# EAGLE schematic Switch and LED matrix (EAGLE 7.3.0)
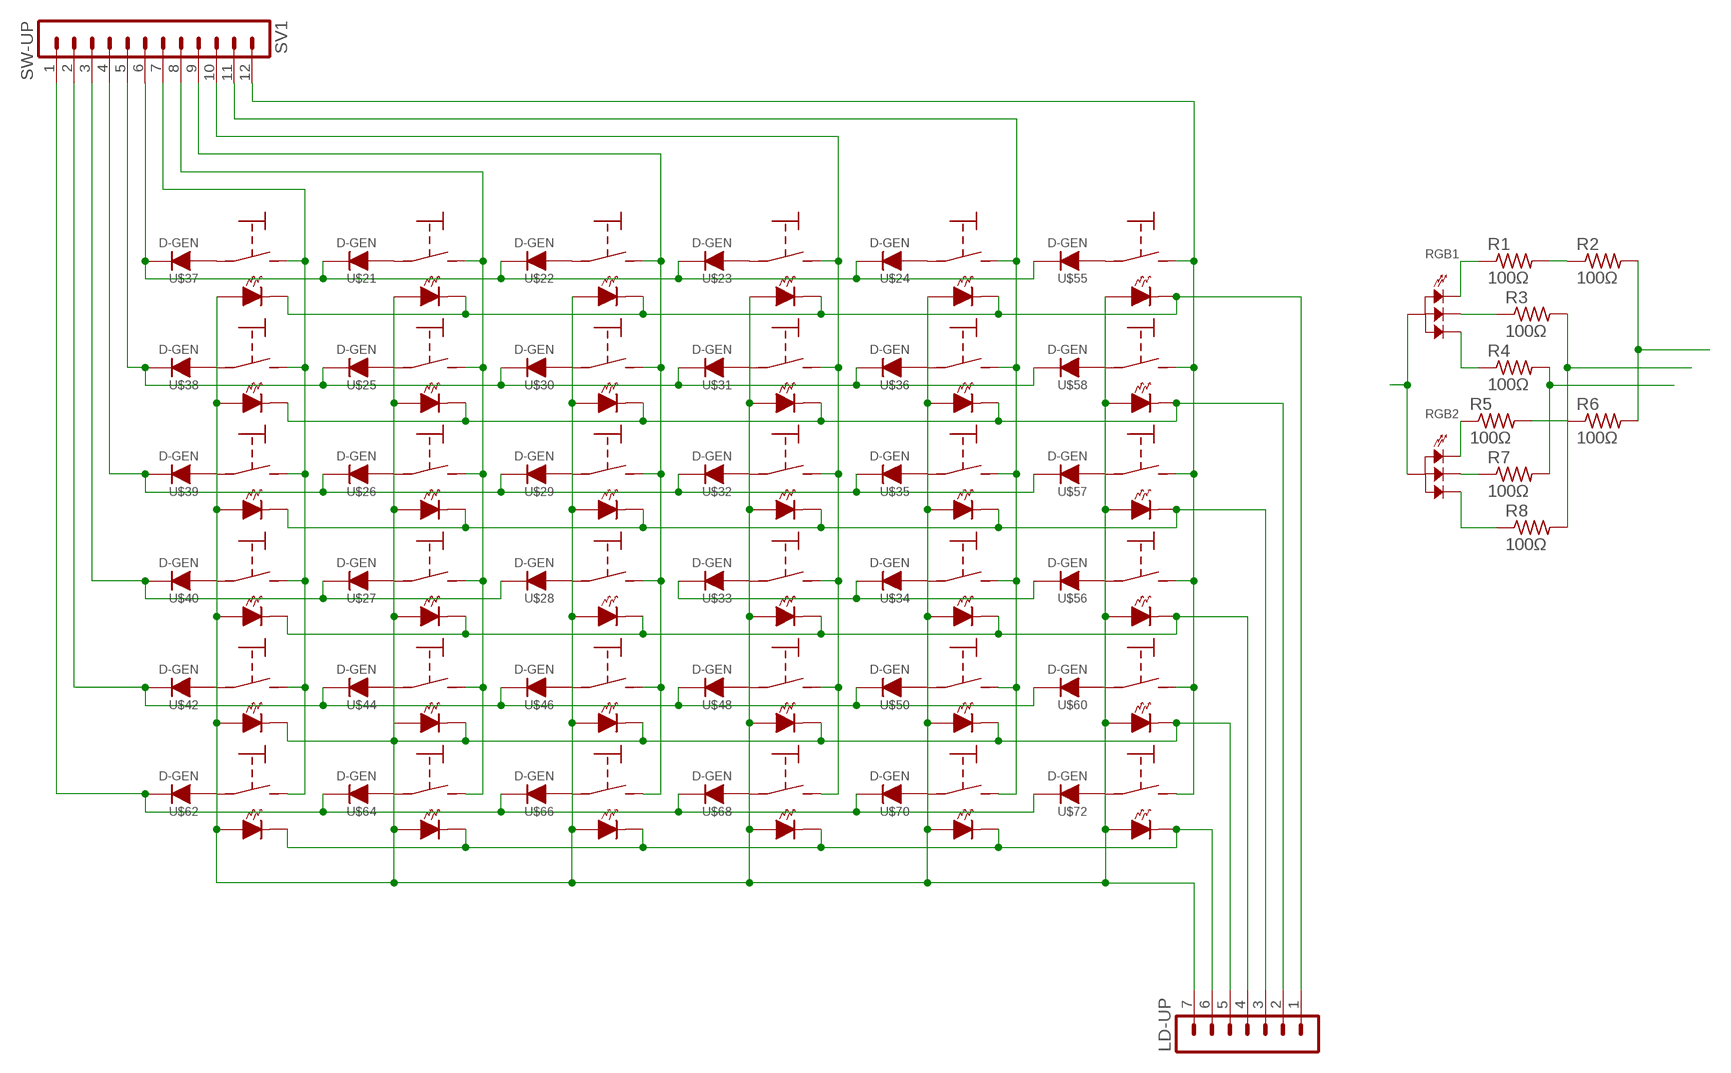
[diagram p0: schematic, sheet 1]

## Parts
LD-UP  MA07-1  [MA07-1]
R1  100Ω  R-US_M2012  [M2012]
R2  100Ω  R-US_M2012  [M2012]
R3  100Ω  R-US_M2012  [M2012]
R4  100Ω  R-US_M2012  [M2012]
R5  100Ω  R-US_M2012  [M2012]
R6  100Ω  R-US_M2012  [M2012]
R7  100Ω  R-US_M2012  [M2012]
R8  100Ω  R-US_M2012  [M2012]
RGB1  LED-CMN_A_SMD  [HSMF-C114]
RGB2  LED-CMN_A_SMD  [HSMF-C114]
SV1  SW-UP  MA12-1  [MA12-1]
U$1  SW-CHERRY_MX  [CHERRY_MX]
U$2  SW-CHERRY_MX  [CHERRY_MX]
U$3  SW-CHERRY_MX  [CHERRY_MX]
U$4  SW-CHERRY_MX  [CHERRY_MX]
U$5  SW-CHERRY_MX  [CHERRY_MX]
U$6  SW-CHERRY_MX  [CHERRY_MX]
U$7  SW-CHERRY_MX  [CHERRY_MX]
U$8  SW-CHERRY_MX  [CHERRY_MX]
U$9  SW-CHERRY_MX  [CHERRY_MX]
U$10  SW-CHERRY_MX  [CHERRY_MX]
U$11  SW-CHERRY_MX  [CHERRY_MX]
U$12  SW-CHERRY_MX  [CHERRY_MX]
U$13  SW-CHERRY_MX  [CHERRY_MX]
U$14  SW-CHERRY_MX  [CHERRY_MX]
U$15  SW-CHERRY_MX  [CHERRY_MX]
U$16  SW-CHERRY_MX  [CHERRY_MX]
U$17  SW-CHERRY_MX  [CHERRY_MX]
U$18  SW-CHERRY_MX  [CHERRY_MX]
U$19  SW-CHERRY_MX  [CHERRY_MX]
U$20  SW-CHERRY_MX  [CHERRY_MX]
U$21  D-GEN  [D-GEN]
U$22  D-GEN  [D-GEN]
U$23  D-GEN  [D-GEN]
U$24  D-GEN  [D-GEN]
U$25  D-GEN  [D-GEN]
U$26  D-GEN  [D-GEN]
U$27  D-GEN  [D-GEN]
U$28  D-GEN  [D-GEN]
U$29  D-GEN  [D-GEN]
U$30  D-GEN  [D-GEN]
U$31  D-GEN  [D-GEN]
U$32  D-GEN  [D-GEN]
U$33  D-GEN  [D-GEN]
U$34  D-GEN  [D-GEN]
U$35  D-GEN  [D-GEN]
U$36  D-GEN  [D-GEN]
U$37  D-GEN  [D-GEN]
U$38  D-GEN  [D-GEN]
U$39  D-GEN  [D-GEN]
U$40  D-GEN  [D-GEN]
U$41  SW-CHERRY_MX  [CHERRY_MX]
U$42  D-GEN  [D-GEN]
U$43  SW-CHERRY_MX  [CHERRY_MX]
U$44  D-GEN  [D-GEN]
U$45  SW-CHERRY_MX  [CHERRY_MX]
U$46  D-GEN  [D-GEN]
U$47  SW-CHERRY_MX  [CHERRY_MX]
U$48  D-GEN  [D-GEN]
U$49  SW-CHERRY_MX  [CHERRY_MX]
U$50  D-GEN  [D-GEN]
U$51  SW-CHERRY_MX  [CHERRY_MX]
U$52  SW-CHERRY_MX  [CHERRY_MX]
U$53  SW-CHERRY_MX  [CHERRY_MX]
U$54  SW-CHERRY_MX  [CHERRY_MX]
U$55  D-GEN  [D-GEN]
U$56  D-GEN  [D-GEN]
U$57  D-GEN  [D-GEN]
U$58  D-GEN  [D-GEN]
U$59  SW-CHERRY_MX  [CHERRY_MX]
U$60  D-GEN  [D-GEN]
U$61  SW-CHERRY_MX  [CHERRY_MX]
U$62  D-GEN  [D-GEN]
U$63  SW-CHERRY_MX  [CHERRY_MX]
U$64  D-GEN  [D-GEN]
U$65  SW-CHERRY_MX  [CHERRY_MX]
U$66  D-GEN  [D-GEN]
U$67  SW-CHERRY_MX  [CHERRY_MX]
U$68  D-GEN  [D-GEN]
U$69  SW-CHERRY_MX  [CHERRY_MX]
U$70  D-GEN  [D-GEN]
U$71  SW-CHERRY_MX  [CHERRY_MX]
U$72  D-GEN  [D-GEN]

## Nets
LD-CMN_ANODE: LD-UP.7 U$1.LD-C U$3.LD-C U$4.LD-C U$5.LD-C U$6.LD-C U$8.LD-C U$9.LD-C U$10.LD-C U$11.LD-C U$13.LD-C U$14.LD-C U$15.LD-C U$16.LD-C U$18.LD-C U$19.LD-C U$20.LD-C U$41.LD-C U$43.LD-C U$45.LD-C U$47.LD-C U$49.LD-C U$51.LD-C U$52.LD-C U$53.LD-C U$54.LD-C U$59.LD-C U$61.LD-C U$63.LD-C U$65.LD-C U$67.LD-C U$69.LD-C U$71.LD-C
N$1: U$2.SW-C U$21.ANODE
N$2: U$3.SW-C U$22.ANODE
N$3: U$4.SW-C U$23.ANODE
N$4: U$5.SW-C U$24.ANODE
N$5: U$7.SW-C U$25.ANODE
N$6: U$12.SW-C U$26.ANODE
N$7: U$17.SW-C U$27.ANODE
N$8: U$18.SW-C U$28.ANODE
N$9: U$13.SW-C U$29.ANODE
N$10: U$8.SW-C U$30.ANODE
N$11: U$9.SW-C U$31.ANODE
N$12: U$14.SW-C U$32.ANODE
N$13: U$19.SW-C U$33.ANODE
N$14: U$20.SW-C U$34.ANODE
N$15: U$15.SW-C U$35.ANODE
N$16: U$10.SW-C U$36.ANODE
N$17: U$1.SW-C U$37.ANODE
N$18: U$6.SW-C U$38.ANODE
N$19: U$11.SW-C U$39.ANODE
N$20: U$16.SW-C U$40.ANODE
N$21: R5.1 RGB2.CATH1
N$22: LD-UP.1 U$1.LD-A U$2.LD-A U$3.LD-A U$4.LD-A U$5.LD-A U$51.LD-A
N$23: LD-UP.2 U$6.LD-A U$7.LD-A U$8.LD-A U$9.LD-A U$10.LD-A U$52.LD-A
N$24: LD-UP.3 U$11.LD-A U$12.LD-A U$13.LD-A U$14.LD-A U$15.LD-A U$53.LD-A
N$25: LD-UP.4 U$16.LD-A U$17.LD-A U$18.LD-A U$19.LD-A U$20.LD-A U$54.LD-A
N$26: LD-UP.5 U$2.LD-C U$7.LD-C U$12.LD-C U$17.LD-C U$41.LD-A U$43.LD-A U$45.LD-A U$47.LD-A U$49.LD-A U$59.LD-A
N$27: LD-UP.6 U$61.LD-A U$63.LD-A U$65.LD-A U$67.LD-A U$69.LD-A U$71.LD-A
N$28: R7.1 RGB2.CATH2
N$29: R8.1 RGB2.CATH3
N$30: R1.2 R2.1
N$31: U$33.CATHODE U$34.CATHODE U$56.CATHODE
N$32: R1.1 RGB1.CATH1
N$33: R5.2 R6.1
N$34: R3.1 RGB1.CATH2
N$35: R4.1 RGB1.CATH3
N$36: RGB1.ANODE RGB2.ANODE
N$37: R4.2 R7.2
N$38: R3.2 R8.2
N$39: R2.2 R6.2
N$44: U$41.SW-C U$42.ANODE
N$45: U$51.SW-C U$55.ANODE
N$46: U$43.SW-C U$44.ANODE
N$47: U$54.SW-C U$56.ANODE
N$48: U$45.SW-C U$46.ANODE
N$49: U$53.SW-C U$57.ANODE
N$50: U$47.SW-C U$48.ANODE
N$51: U$52.SW-C U$58.ANODE
N$52: U$49.SW-C U$50.ANODE
N$53: U$61.SW-C U$62.ANODE
N$54: U$59.SW-C U$60.ANODE
N$55: U$63.SW-C U$64.ANODE
N$56: U$65.SW-C U$66.ANODE
N$57: U$67.SW-C U$68.ANODE
N$58: U$69.SW-C U$70.ANODE
N$59: U$71.SW-C U$72.ANODE
SW-A1: SV1.12 U$51.SW-A U$52.SW-A U$53.SW-A U$54.SW-A U$59.SW-A U$71.SW-A
SW-A2: SV1.11 U$5.SW-A U$10.SW-A U$15.SW-A U$20.SW-A U$49.SW-A U$69.SW-A
SW-A3: SV1.10 U$4.SW-A U$9.SW-A U$14.SW-A U$19.SW-A U$47.SW-A U$67.SW-A
SW-A4: SV1.9 U$3.SW-A U$8.SW-A U$13.SW-A U$18.SW-A U$45.SW-A U$65.SW-A
SW-A5: SV1.8 U$2.SW-A U$7.SW-A U$12.SW-A U$17.SW-A U$43.SW-A U$63.SW-A
SW-A6: SV1.7 U$1.SW-A U$6.SW-A U$11.SW-A U$16.SW-A U$41.SW-A U$61.SW-A
SW-C1: SV1.6 U$21.CATHODE U$22.CATHODE U$23.CATHODE U$24.CATHODE U$37.CATHODE U$55.CATHODE
SW-C2: SV1.5 U$25.CATHODE U$30.CATHODE U$31.CATHODE U$36.CATHODE U$38.CATHODE U$58.CATHODE
SW-C3: SV1.4 U$26.CATHODE U$29.CATHODE U$32.CATHODE U$35.CATHODE U$39.CATHODE U$57.CATHODE
SW-C4: SV1.3 U$27.CATHODE U$28.CATHODE U$40.CATHODE
SW-C5: SV1.2 U$42.CATHODE U$44.CATHODE U$46.CATHODE U$48.CATHODE U$50.CATHODE U$60.CATHODE
SW-C6: SV1.1 U$62.CATHODE U$64.CATHODE U$66.CATHODE U$68.CATHODE U$70.CATHODE U$72.CATHODE

## Library data of the parts
LD-UP = con-lstb:MA07-1: PIN HEADER; OC_FARNELL: unknown; OC_NEWARK: unknown
R1-R8 = rcl:R-US_: RESISTOR, American symbol
RGB1 RGB2 = pOlson:LED-CMN_A_SMD
SV1 = con-lstb:MA12-1: PIN HEADER; OC_FARNELL: unknown; OC_NEWARK: unknown
U$1-U$20 U$41 U$43 U$45 U$47 U$49 U$51-U$54 U$59 U$61 U$63 U$65 U$67 U$69 U$71 = pOlson:SW-CHERRY_MX
U$21-U$40 U$42 U$44 U$46 U$48 U$50 U$55-U$58 U$60 U$62 U$64 U$66 U$68 U$70 U$72 = pOlson:D-GEN: Generic 1N400X family diode